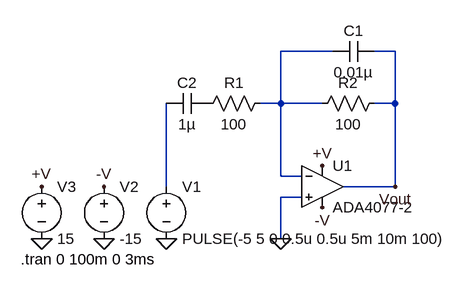
[diagram p0: schematic Draft3.asc]
Draft3.asc, the LTspice schematic file:
Version 4.1
SHEET 1 880 680
WIRE 192 -48 112 -48
WIRE 288 -48 256 -48
WIRE 112 32 112 -48
WIRE 112 32 80 32
WIRE 176 32 112 32
WIRE 288 32 288 -48
WIRE 288 32 256 32
WIRE 112 144 112 32
WIRE 144 144 112 144
WIRE -64 160 -64 32
WIRE 288 160 288 32
WIRE 288 160 208 160
WIRE 144 176 112 176
WIRE 112 240 112 176
FLAG -256 240 0
FLAG -160 240 0
FLAG -256 160 +V
FLAG 176 128 +V
FLAG -160 160 -V
FLAG 176 192 -V
FLAG -64 240 0
FLAG 112 240 0
FLAG 288 160 Vout
SYMBOL OpAmps\\ADA4077-2 176 96 R0
SYMATTR InstName U1
SYMBOL res 96 16 R90
WINDOW 0 0 56 VBottom 2
WINDOW 3 32 56 VTop 2
SYMATTR InstName R1
SYMATTR Value 100
SYMBOL res 272 16 R90
WINDOW 0 0 56 VBottom 2
WINDOW 3 32 56 VTop 2
SYMATTR InstName R2
SYMATTR Value 100
SYMBOL voltage -64 144 R0
WINDOW 123 0 0 Left 0
WINDOW 39 0 0 Left 0
SYMATTR InstName V1
SYMATTR Value PULSE(-5 5 0 0.5u 0.5u 5m 10m 100)
SYMBOL voltage -160 144 R0
WINDOW 123 0 0 Left 0
WINDOW 39 0 0 Left 0
SYMATTR InstName V2
SYMATTR Value -15
SYMBOL cap 256 -64 R90
WINDOW 0 0 32 VBottom 2
WINDOW 3 32 32 VTop 2
SYMATTR InstName C1
SYMATTR Value 0.01µ
SYMBOL voltage -256 144 R0
WINDOW 123 0 0 Left 0
WINDOW 39 0 0 Left 0
SYMATTR InstName V3
SYMATTR Value 15
SYMBOL cap 0 16 R90
WINDOW 0 0 32 VBottom 2
WINDOW 3 32 32 VTop 2
SYMATTR InstName C2
SYMATTR Value 1µ
TEXT -288 272 Left 2 !.tran 0 100m 0 3ms

The netlist it stands for:
* Draft3.asc
X§U1 0 N001 +V -V Vout ADA4077-2  ; pins In+ In- V+ V- OUT
R1 N001 P001 100
R2 Vout N001 100
V1 N002 0 PULSE(-5 5 0 0.5u 0.5u 5m 10m 100)
V2 -V 0 -15
C1 Vout N001 0.01µ
V3 +V 0 15
C2 P001 N002 1µ
.tran 0 100m 0 3ms
.backanno
.end